# EAGLE schematic eeprom (EAGLE 7.2.0)
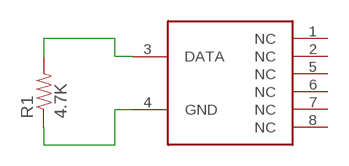
[diagram p0: schematic, sheet 1]

## Parts
R1  4.7K  RESISTOR0805-RES  [0805]
U$1  DS2433  DS2433SOIC  [SOIC8]

## Nets
N$1: R1.1 U$1.4(GND)
N$2: R1.2 U$1.3(DATA)
Unconnected: U$1.1(NC) U$1.2(NC) U$1.5(NC) U$1.6(NC) U$1.7(NC) U$1.8(NC)

## Library data of the parts
R1 = SparkFun-Passives:RESISTOR: Resistor Basic schematic elements and footprints for 0603, 1206, and PTH resistors.
U$1 = TuansLib:DS2433